# Altium schematic sheet connector_b.SchDoc
size A3; DrawnBy: Elio F; Engineer: Elio F; Revision: A; SheetNumber: 4; SheetTotal: 11; Sheet Title: Connector B
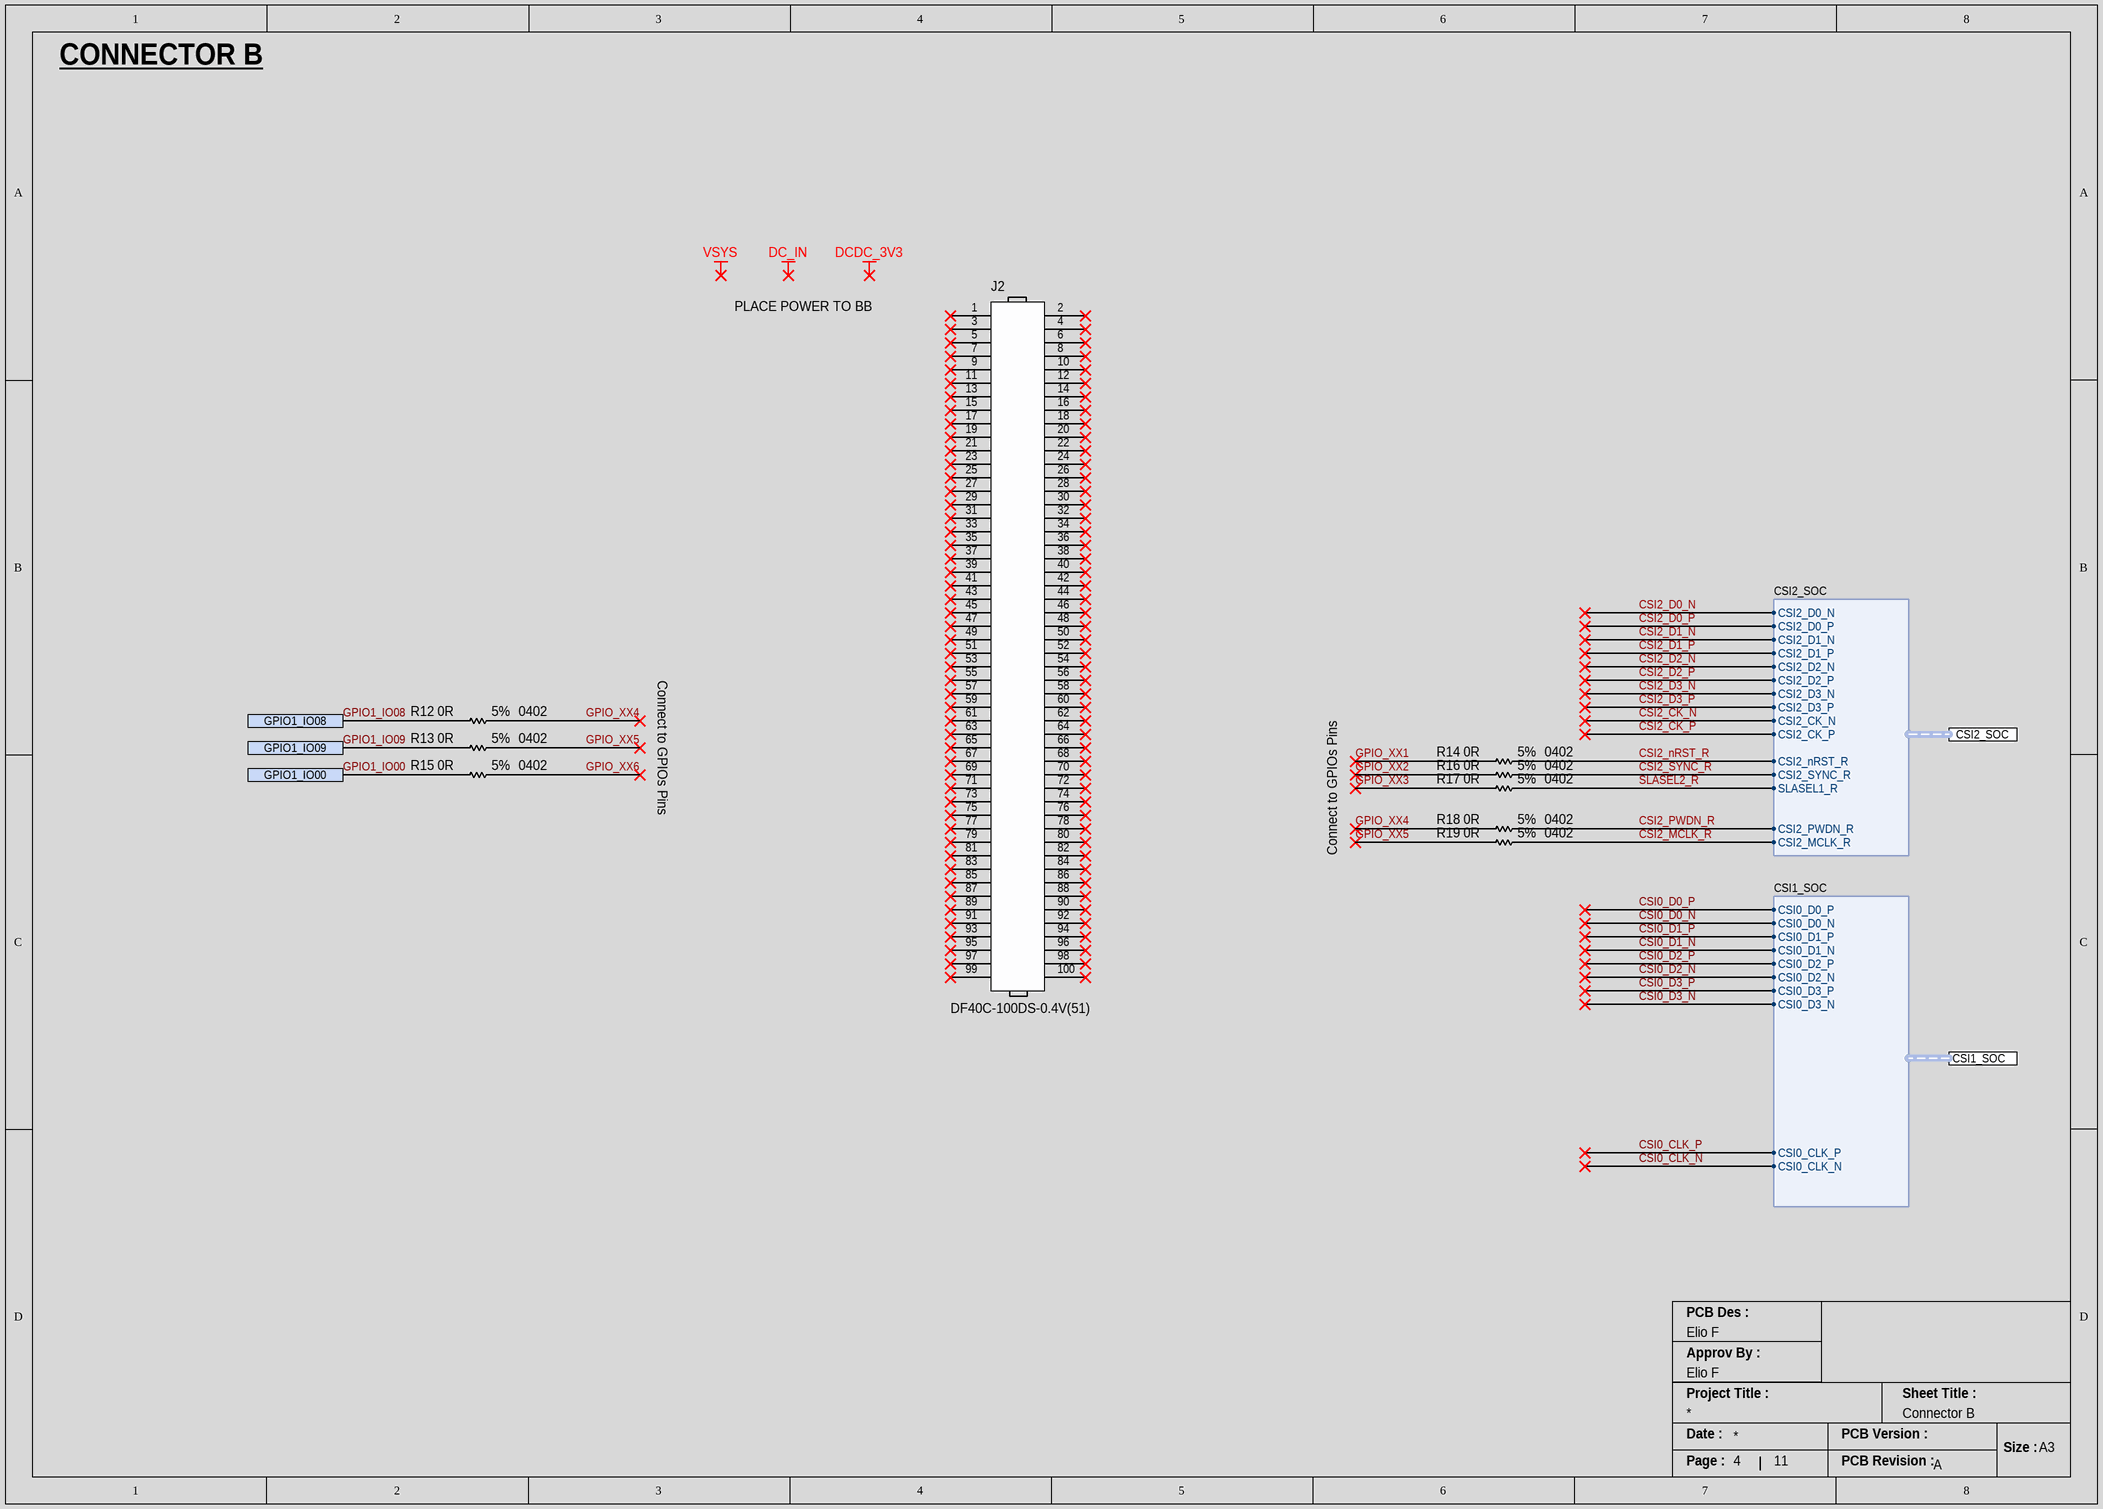
[diagram p0: connector_b.SchDoc]

## Parts
J2  DF40C-100DS-0.4V(51)  [CONN_B2B_HIROSE_DF40C-100DS-0.4V(51)]
R12  Case Code (Imperial): 0402  Tolerance: 5%  Resistance: 0R  [RES_0402_RESC1005X04N]  (hidden comment: ERJ-2GE0R00X)
R13  Case Code (Imperial): 0402  Tolerance: 5%  Resistance: 0R  [RES_0402_RESC1005X04N]  (hidden comment: ERJ-2GE0R00X)
R14  Case Code (Imperial): 0402  Tolerance: 5%  Resistance: 0R  [RES_0402_RESC1005X04N]  (hidden comment: ERJ-2GE0R00X)
R15  Case Code (Imperial): 0402  Tolerance: 5%  Resistance: 0R  [RES_0402_RESC1005X04N]  (hidden comment: ERJ-2GE0R00X)
R16  Case Code (Imperial): 0402  Tolerance: 5%  Resistance: 0R  [RES_0402_RESC1005X04N]  (hidden comment: ERJ-2GE0R00X)
R17  Case Code (Imperial): 0402  Tolerance: 5%  Resistance: 0R  [RES_0402_RESC1005X04N]  (hidden comment: ERJ-2GE0R00X)
R18  Case Code (Imperial): 0402  Tolerance: 5%  Resistance: 0R  [RES_0402_RESC1005X04N]  (hidden comment: ERJ-2GE0R00X)
R19  Case Code (Imperial): 0402  Tolerance: 5%  Resistance: 0R  [RES_0402_RESC1005X04N]  (hidden comment: ERJ-2GE0R00X)

## Ports
CSI1_SOC (harness CSI1_SOC), CSI2_SOC (harness CSI2_SOC), GPIO1_IO00, GPIO1_IO08, GPIO1_IO09

## Harnesses
CSI2_SOC: CSI2_D0_N, CSI2_D0_P, CSI2_D1_N, CSI2_D1_P, CSI2_D2_N, CSI2_D2_P, CSI2_D3_N, CSI2_D3_P, CSI2_CK_N, CSI2_CK_P, CSI2_nRST_R, CSI2_SYNC_R, SLASEL1_R, CSI2_PWDN_R, CSI2_MCLK_R
CSI1_SOC: CSI0_D0_P, CSI0_D0_N, CSI0_D1_P, CSI0_D1_N, CSI0_D2_P, CSI0_D2_N, CSI0_D3_P, CSI0_D3_N, CSI0_CLK_P, CSI0_CLK_N

## Nets
CSI0_CLK_N: port CSI1_SOC.CSI0_CLK_N
CSI0_CLK_P: port CSI1_SOC.CSI0_CLK_P
CSI0_D0_N: port CSI1_SOC.CSI0_D0_N
CSI0_D0_P: port CSI1_SOC.CSI0_D0_P
CSI0_D1_N: port CSI1_SOC.CSI0_D1_N
CSI0_D1_P: port CSI1_SOC.CSI0_D1_P
CSI0_D2_N: port CSI1_SOC.CSI0_D2_N
CSI0_D2_P: port CSI1_SOC.CSI0_D2_P
CSI0_D3_N: port CSI1_SOC.CSI0_D3_N
CSI0_D3_P: port CSI1_SOC.CSI0_D3_P
CSI2_CK_N: port CSI2_SOC.CSI2_CK_N
CSI2_CK_P: port CSI2_SOC.CSI2_CK_P
CSI2_D0_N: port CSI2_SOC.CSI2_D0_N
CSI2_D0_P: port CSI2_SOC.CSI2_D0_P
CSI2_D1_N: port CSI2_SOC.CSI2_D1_N
CSI2_D1_P: port CSI2_SOC.CSI2_D1_P
CSI2_D2_N: port CSI2_SOC.CSI2_D2_N
CSI2_D2_P: port CSI2_SOC.CSI2_D2_P
CSI2_D3_N: port CSI2_SOC.CSI2_D3_N
CSI2_D3_P: port CSI2_SOC.CSI2_D3_P
CSI2_MCLK_R: R19.2 ; port CSI2_SOC.CSI2_MCLK_R
CSI2_nRST_R: R14.2 ; port CSI2_SOC.CSI2_nRST_R
CSI2_PWDN_R: R18.2 ; port CSI2_SOC.CSI2_PWDN_R
CSI2_SYNC_R: R16.2 ; port CSI2_SOC.CSI2_SYNC_R
GPIO1_IO00: R15.1 ; port GPIO1_IO00
GPIO1_IO08: R12.1 ; port GPIO1_IO08
GPIO1_IO09: R13.1 ; port GPIO1_IO09
GPIO_XX1: R14.1
GPIO_XX2: R16.1
GPIO_XX3: R17.1
GPIO_XX4: R12.2 R18.1
GPIO_XX5: R13.2 R19.1
GPIO_XX6: R15.2
SLASEL2_R: R17.2 ; port CSI2_SOC.SLASEL1_R

Not connected (* = marked no-connect by the designer): J2 1* 2* 3* 4* 5* 6* 7* 8* 9* 10* 11* 12* 13* 14* 15* 16* 17* 18* 19* 20* 21* 22* 23* 24* 25* 26* 27* 28* 29* 30* 31* 32* 33* 34* 35* 36* 37* 38* 39* 40* 41* 42* 43* 44* 45* 46* 47* 48* 49* 50* 51* 52* 53* 54* 55* 56* 57* 58* 59* 60* 61* 62* 63* 64* 65* 66* 67* 68* 69* 70* 71* 72* 73* 74* 75* 76* 77* 78* 79* 80* 81* 82* 83* 84* 85* 86* 87* 88* 89* 90* 91* 92* 93* 94* 95* 96* 97* 98* 99* 100*

## Notes on the sheet
- CONNECTOR B
- PLACE POWER TO BB
- Connect to GPIOs Pins
- Labels drawn without touching a wire or pin: DC_IN, DCDC_3V3, VSYS
- PCB Des :
- Approv By :
- Project Title :
- Sheet Title :
- Date :
- PCB Version :
- Size :
- A3
- Page :
- PCB Revision :

## Library data of the parts
J2 = CONN_B2B_100P_RE_DF40C-100DS-0.4V(51): Board-to-Board Connector with 0.4-mm Pitch, 1.5 - 4.0-mm Height - DF40 Series (HIROSE ELECTRIC); Voltage Rating: 30V; Current Rating: 300mA; Connector Type: Receptacle; Number of Positions: 100; Contact Resistance: 90mR; Pitch: 0.4mm; Mated Stacking Heights: 1.5mm; Contact Pitch: 400um; Supplier 1: Digikey; Manufacturer: Hirose; Manufacturer Part Number: DF40C-100DS-0.4V(51); RoHS: Yes; Category: Headers and Wire Housings; Stock 1: 4275; Pricing 1: 1=1.91, 10=1.661, 25=1.5908, 50=1.5554, 100=1.4847, 250=1.34328, 500=1.23724, 1000=1.0605, 2500=0.9898 (USD); Mount: Surface Mount; Contact Material: Bronze; Contact Plating: Gold; Housing Material: Polymer; Housing Color: Black; Min Operating Temperature: -35°C; Max Operating Temperature: 85°C; Number of Rows: 2; Packaging: Tape and Reel; Package Quantity: 1; Termination: SMD/SMT; Number of Contacts: 100; Orientation: Straight; Series: DF40; Max Current Rating: 300mA; Max Voltage Rating (AC): 30V; Gender: Receptacle; Contact Voltage Rating (AC): 30V; Contact Voltage Rating (DC): 30V; Length: 22.6mm; Depth: 3.38mm; Radiation Hardening: No; Reach SVHC Compliant: No; Lead Free: Lead Free; RoHS Compliant: Yes; ComponentLink1URL: https://datasheet.ciiva.com/26948/getdatasheetpartid-441624-26948933.pdf?src-supplier=Verical; ComponentLink1Description: https://datasheet.ciiva.com/26948/getdatasheetpartid-441624-26948933.pdf?src-supplier=Verical; ComponentLink2URL: https://datasheet.ciiva.com/46408/1824826-46408894.pdf?src-supplier=Element14; ComponentLink2Description: https://datasheet.ciiva.com/46408/1824826-46408894.pdf?src-supplier=Element14; Supplier Part Number 1: H11615CT-ND
R12-R19 = RES_0R_5%_100mW_0402: SMD Chip Resistor, Jumper, 0 ohm, 100 mW, 0402 [1005 Metric], Thick Film, General Purpose; Manufacturer: Panasonic; Power Rating: 100mW; Voltage Rating: 50V; Temperature Coefficient: 600ppm/°C; Supplier 1: Mouser; Manufacturer Part Number: ERJ-2GE0R00X; RoHS: Yes; Category: Chip SMD Resistors; Stock 1: 10989354; Pricing 1: 1=0.1, 10=0.013, 50=0.013, 100=0.006, 1000=0.004, 2500=0.003, 10000=0.003 (USD); Mount: Surface Mount; Case/Package: 0402; Contact Plating: Tin; Case Code (Metric): 1005; Size Code: 0402; Min Operating Temperature: -55°C; Max Operating Temperature: 155°C; Resistor Type: Thick Film; Packaging: Cut Tape; Package Quantity: 10000; Number of Terminations: 2; Termination: SMD/SMT; Max Power Dissipation: 100mW; Voltage Rating (DC): 50V; Features: Automotive AEC-Q200; Series: ERJ; Construction: Rectangular; Technology: THICK FILM; Length: 1mm; Width: 0.5mm; Height: 0.35mm; Depth: 0.5mm; Ratings: AEC-Q200; Radiation Hardening: No; Reach SVHC Compliant: No; Military Standard: Not; Lead Free: Lead Free; RoHS Compliant: Yes; ComponentLink1URL: https://datasheet.ciiva.com/11821/0900766b80f806dd-11821176.pdf?src-supplier=Rs; ComponentLink1Description: https://datasheet.ciiva.com/11821/0900766b80f806dd-11821176.pdf?src-supplier=Rs; ComponentLink2URL: https://datasheet.ciiva.com/43460/1678796-43460347.pdf?src-supplier=Farnell; ComponentLink2Description: https://datasheet.ciiva.com/43460/1678796-43460347.pdf?src-supplier=Farnell; ComponentLink3URL: https://datasheet.ciiva.com/46389/1678796-46389518.pdf?src-supplier=Element14; ComponentLink3Description: https://datasheet.ciiva.com/46389/1678796-46389518.pdf?src-supplier=Element14; ComponentLink4URL: https://datasheet.ciiva.com/5959/1678796-5959692.pdf?src-supplier=Farnell; ComponentLink4Description: https://datasheet.ciiva.com/5959/1678796-5959692.pdf?src-supplier=Farnell; ComponentLink5URL: https://datasheet.ciiva.com/28695/1678796-28695758.pdf?src-supplier=Element14; ComponentLink5Description: https://datasheet.ciiva.com/28695/1678796-28695758.pdf?src-supplier=Element14; ComponentLink6URL: https://datasheet.ciiva.com/16783/70260739-16783734.pdf?src-supplier=Allied+Electronics; ComponentLink6Description: https://datasheet.ciiva.com/16783/70260739-16783734.pdf?src-supplier=Allied+Electronics; ComponentLink7URL: https://datasheet.ciiva.com/16778/70260739-16778335.pdf?src-supplier=Allied+Electronics; ComponentLink7Description: https://datasheet.ciiva.com/16778/70260739-16778335.pdf?src-supplier=Allied+Electronics; ComponentLink8URL: https://datasheet.ciiva.com/48531/aoa0000ce1-48531077.pdf?src-supplier=Avnet; ComponentLink8Description: https://datasheet.ciiva.com/48531/aoa0000ce1-48531077.pdf?src-supplier=Avnet; ComponentLink9URL: https://datasheet.ciiva.com/30097/4aoa0000ce1-30097116.pdf?src-supplier=Onlinecomponents.com; ComponentLink9Description: https://datasheet.ciiva.com/30097/4aoa0000ce1-30097116.pdf?src-supplier=Onlinecomponents.com; Supplier Part Number 1: 667-ERJ-2GE0R00X